# Altium schematic sheet RC522.SchDoc
size A4
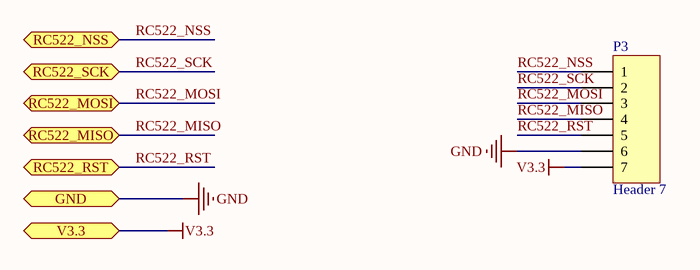
[diagram p0: RC522.SchDoc]

## Parts
P3  Header 7  [HDR1X7]

## Ports
GND, RC522_MISO, RC522_MOSI, RC522_NSS, RC522_RST, RC522_SCK, V3.3

## Nets
GND: P3.6 ; port GND
V3.3: P3.7 ; port V3.3
RC522_MISO: P3.4 ; port RC522_MISO
RC522_MOSI: P3.3 ; port RC522_MOSI
RC522_NSS: P3.1 ; port RC522_NSS
RC522_RST: P3.5 ; port RC522_RST
RC522_SCK: P3.2 ; port RC522_SCK

## Library data of the parts
P3 = Header 7: Header, 7-Pin; LatestRevisionDate: 17-Jul-2002; LatestRevisionNote: Re-released for DXP Platform.; Publisher: Altium Limited